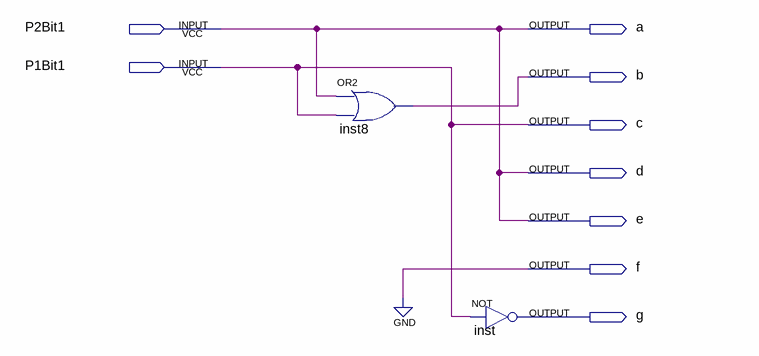
[diagram p0: schematic sheet]
// Quartus schematic EndOfGameWinnerTo7Segments.bdf as structural Verilog: 2 symbols, 9 pins
module EndOfGameWinnerTo7Segments (
  input  P2Bit1,
  input  P1Bit1,
  output a,
  output b,
  output c,
  output d,
  output e,
  output f,
  output g
);

  or inst8 (b, P2Bit1, P1Bit1);
  not inst (g, P1Bit1);

  assign a = P2Bit1;
  assign c = P1Bit1;
  assign d = P2Bit1;
  assign e = P2Bit1;
  assign f = 1'b0;
endmodule
